# Altium schematic sheet Power.SchDoc
size B
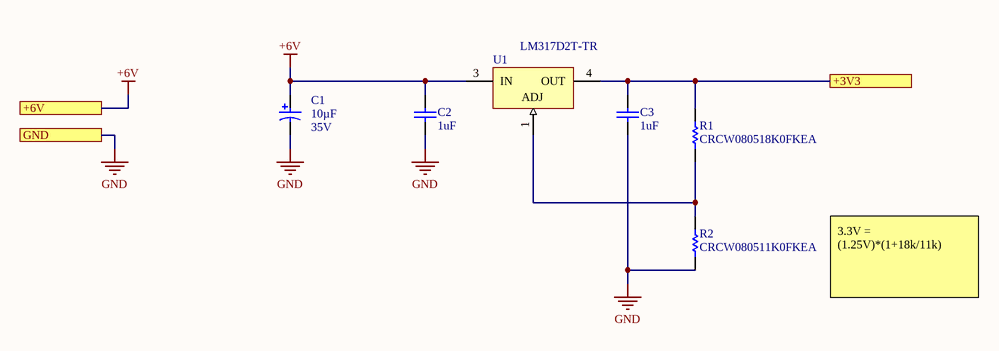
[diagram p0: Power.SchDoc]

## Parts
C1  Rated Voltage: 35V  Capacitance: 10µF  [PNSC-FK-V-B_V]  (hidden comment: EEE-FK1V100UR)
C2  1uF  [CAPC2013X100X50NL20T25]
C3  1uF  [CAPC2013X100X50NL20T25]
R1  CRCW080518K0FKEA  [RESC2013X50X30NL20T20]
R2  CRCW080511K0FKEA  [RESC2013X50X30NL20T20]
U1  LM317D2T-TR  [TO-263_N]

## Ports
+3V3, +6V, GND

## Nets
+6V: C1.1 C2.2 U1.3(IN) ; port +6V
GND: C1.2 C2.1 C3.1 R2.1 ; port GND
+3V3: C3.2 R1.2 U1.4(OUT) ; port +3V3
NetR1_1: R1.1 R2.2 U1.1(ADJ)

## Notes on the sheet
- 3.3V = (1.25V)*(1+18k/11k)

## Library data of the parts
C1 = CMP-2000-06211-1: Aluminum Electrolytic Capacitor, 10 uF, +/- 20%, 35 V, 2-Pin SMD (Size Code B), -55 to 105 degC, RoHS, Tape and Reel; Manufacturer: Panasonic; Impedance: 1.35O; Lifetime@Temperature: 2000Hrs@105°C; Ripple Current: 90mA; Type: Can; Manufacturer URL: http://www.panasonic.com/; Package Reference: FK-V-B; Operating Temp Range: -55to+105°C; Series: FK; Datasheet URL: http://industrial.panasonic.com/cdbs/www-data/pdf/RDE0000/ABA0000C1181.pdf; Mounting Technology: SurfaceMount; Package URL: http://industrial.panasonic.com/cdbs/www-data/pdf/RDE0000/DME0000COL48.pdf; Package Description: 2-Pin Electrolytic Aluminum Capacitor, Body 4.3 x 4.3 mm; Datasheet Version: 03/2016; Case Size/Dimension: Ø4x5.8mm; Operating Temp-Max: 105°C
C2 C3 = CMP-2007-03716-1: Part Number: C0805X105K3RACTU; Manufacturer: Kemet
R1 = CMP-2001-03588-1: Manufacturer: Vishay Dale; Part Number: CRCW080518K0FKEA
R2 = CMP-2001-04924-1: Manufacturer: Vishay Dale; Part Number: CRCW080511K0FKEA
U1 = CMP-0244-00094-1: 1.5A, 1.2V to 37V Adjustable Voltage Regulator, 3-Pin D2PAK, Tape and Reel; DatasheetVersion: 1/11/2011; PackageVersion: 2011; PackageDescription: 3-Pin Transistor Outline Package 2.54 mm Pitch, 15.4 mm Lead Span (D2PAK); ComponentLink2URL: http://www.st.com/internet/com/TECHNICAL_RESOURCES/TECHNICAL_LITERATURE/DATASHEET/CD00000455.pdf; PackageReference: TO-263; ComponentLink1Description: Manufacturer URL; ComponentLink2Description: Datasheet; ComponentLink1URL: http://www.st.com